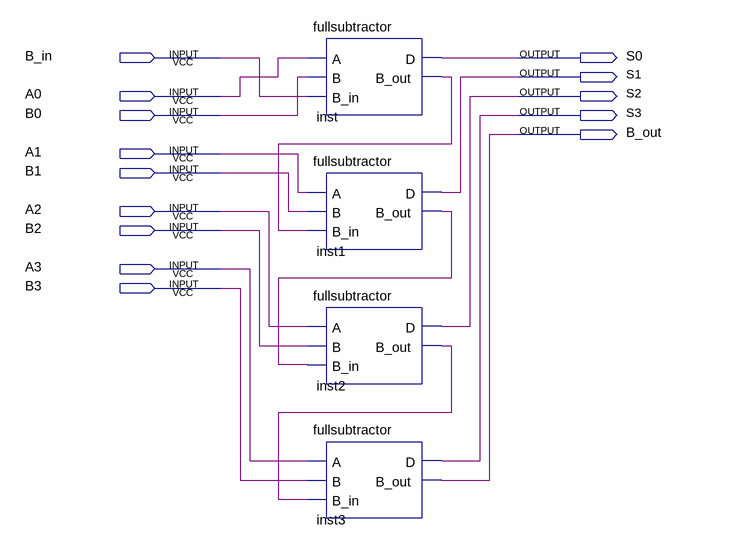
[diagram p0: schematic sheet]
// Quartus schematic subtratorquatrobits.bdf as structural Verilog: 4 symbols, 14 pins
module subtratorquatrobits (
  input  B_in,
  input  A0,
  input  B0,
  input  A1,
  input  B1,
  input  A2,
  input  B2,
  input  A3,
  input  B3,
  output S0,
  output S1,
  output S2,
  output S3,
  output B_out
);

  wire inst1_b_out, inst2_b_out, inst_b_out;

  fullsubtractor inst (.A(A0), .B(B0), .B_in(B_in), .D(S0), .B_out(inst_b_out));
  fullsubtractor inst1 (.A(A1), .B(B1), .B_in(inst_b_out), .D(S1), .B_out(inst1_b_out));
  fullsubtractor inst2 (.A(A2), .B(B2), .B_in(inst1_b_out), .D(S2), .B_out(inst2_b_out));
  fullsubtractor inst3 (.A(A3), .B(B3), .B_in(inst2_b_out), .D(S3), .B_out(B_out));
endmodule
